# EAGLE schematic Inverter_v1p1 (EAGLE 9.6.2)
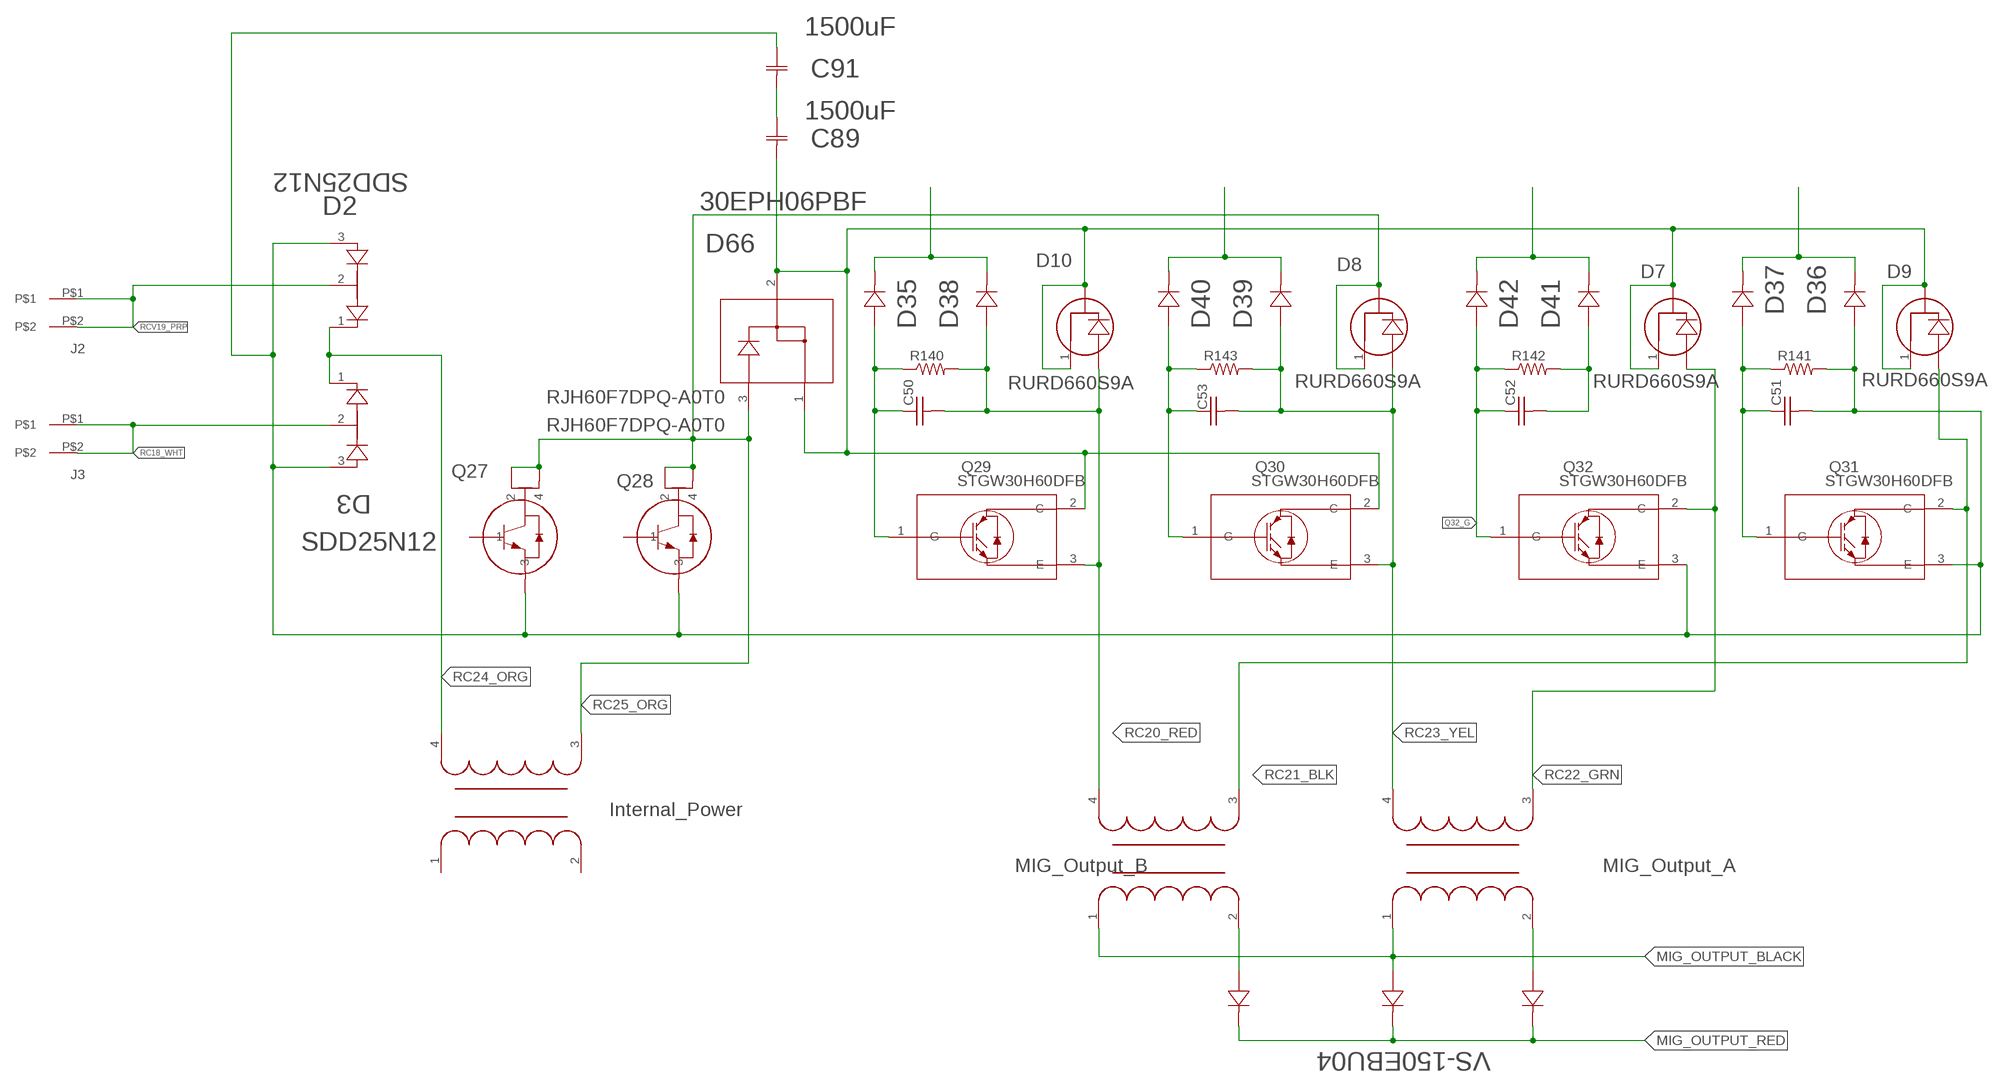
[diagram p0: schematic, sheet 1]

## Parts
C50  C_0805  [0805]
C51  C_0805  [0805]
C52  C_0805  [0805]
C53  C_0805  [0805]
C89  1500uF  C_1500UF  [CAP_SLP152M250H9P3_CND]
C91  1500uF  C_1500UF  [CAP_SLP152M250H9P3_CND]
D2  SDD25N12  [TO-247AD]
D3  SDD25N12  [TO-247AD]
D7  RURD660S9A  [TO-252]
D8  RURD660S9A  [TO-252]
D9  RURD660S9A  [TO-252]
D10  RURD660S9A  [TO-252]
D35  SMAZ18-13-FSMA_DIO-M  [SMA_DIO-M]
D36  SMAZ18-13-FSMA_DIO-M  [SMA_DIO-M]
D37  SMAZ18-13-FSMA_DIO-M  [SMA_DIO-M]
D38  ZJF_638  SMAZ18-13-FSMA_DIO-M  [SMA_DIO-M]
D39  SMAZ18-13-FSMA_DIO-M  [SMA_DIO-M]
D40  SMAZ18-13-FSMA_DIO-M  [SMA_DIO-M]
D41  SMAZ18-13-FSMA_DIO-M  [SMA_DIO-M]
D42  SMAZ18-13-FSMA_DIO-M  [SMA_DIO-M]
D66  30EPH06PBF  [TO-247AC_MOD_VIS]
J2  2-pos  3.81MM_1_X_2_RT_ANGLE_PLUG_HEADER  [2_3.81MM_PITCH]
J3  2-pos  3.81MM_1_X_2_RT_ANGLE_PLUG_HEADER  [2_3.81MM_PITCH]
Q27  RJH60F7DPQ-A0T0  [TO-247A_REN]
Q28  RJH60F7DPQ-A0T0  [TO-247A_REN]
Q29  STGW30H60DFB  [TO-247_STM]
Q30  STGW30H60DFB  [TO-247_STM]
Q31  STGW30H60DFB  [TO-247_STM]
Q32  STGW30H60DFB  [TO-247_STM]
R140  R_0805  [0805]
R141  R_0805  [0805]
R142  R_0805  [0805]
R143  R_0805  [0805]
U$1  GENERIC_TRANSFORMER  [GENERIC_TRANSFORMER]
U$2  GENERIC_TRANSFORMER  [GENERIC_TRANSFORMER]
U$3  GENERIC_TRANSFORMER  [GENERIC_TRANSFORMER]
U$4  VS-150EBU04  [POWER_TAB]
U$5  VS-150EBU04  [POWER_TAB]
U$6  VS-150EBU04  [POWER_TAB]

## Nets
D66_1: C89.2 D7.1(C1) D7.3(C2) D9.1(C1) D9.3(C2) D10.1(C1) D10.3(C2) D66.1 D66.2 Q29.2(C) Q30.2(C)
MIG_OUTPUT_BLACK: U$1.1 U$2.1 U$5.2
MIG_OUTPUT_RED: U$4.1 U$5.1 U$6.1
N$1: U$1.2 U$4.2
N$2: C50.1 D35.2 Q29.1(G) R140.1
N$3: D39.1 D40.1
N$4: U$2.2 U$6.2
N$5: C89.1 C91.2
N$6: D35.1 D38.1
N$7: C53.1 D40.2 Q30.1(G) R143.1
N$8: C51.1 D37.2 Q31.1(G) R141.1
N$9: C52.2 D41.2 R142.2
N$10: D41.1 D42.1
N$11: C51.2 C91.1 D2.3 D3.3 D36.2 Q27.3 Q28.3 Q31.3(E) Q32.3(E) R141.2
N$12: D36.1 D37.1
Q32_G: C52.1 D42.2 Q32.1(G) R142.1
RC18_WHT: D3.2 J3.P$1 J3.P$2
RC20_RED: C50.2 D10.2(A) D38.2 Q29.3(E) R140.2 U$1.4
RC21_BLK: D9.2(A) Q31.2(C) U$1.3
RC22_GRN: D7.2(A) Q32.2(C) U$2.3
RC23_YEL: C53.2 D8.2(A) D39.2 Q30.3(E) R143.2 U$2.4
RC24_ORG: D2.1 D3.1 U$3.4
RC25_ORG: D8.1(C1) D8.3(C2) D66.3 Q27.2 Q27.4 Q28.2 Q28.4 U$3.3
RCV19_PRP: D2.2 J2.P$1 J2.P$2
Unconnected: Q27.1 Q28.1 U$3.1 U$3.2

## Notes on the sheet
- Internal_Power
- MIG_Output_B | MIG_Output_A

## Library data of the parts
C50-C53 = 3D_MIG_Controller:C_0805
C89 C91 = 3D_MIG_Controller:C_1500UF; BUILT_BY: EMA_Kyle; COPYRIGHT: Copyright (C) 2018 Accelerated Designs. All rights reserved; DATASHEET: https://www.cde.com/resources/catalogs/SLP.pdf; MANUFACTURER_PART_NUMBER: SLP152M250H9P3; SOURCELIBRARY: Add_to_database_2021-04-21; VENDOR: Cornell Dubilier
D2 D3 = 3D_MIG_Controller:SDD25N12
D7-D10 = 3D_MIG_Controller:RURD660S9A
D35-D42 = 3D_MIG_Controller:SMAZ18-13-F; BUILT_BY: EMA_UL_Team; MANUFACTURER_PART_NUMBER: SMAZ18-13-F; SOURCELIBRARY: DiodesInc_2015-05-08; VENDOR: Diodes Inc
D66 = 3D_MIG_Controller:30EPH06PBF; BUILT_BY: EMA_UL_Team; MANUFACTURER_PART_NUMBER: 30EPH06PBF; SOURCELIBRARY: Vishay_2020-02-10; VENDOR: Vishay
J2 J3 = 3D_MIG_Controller:3.81MM_1_X_2_RT_ANGLE_PLUG_HEADER: TERM BLOCK HDR 2POS 90DEG 3.81MM; PARTNO: 691322310002
Q27 Q28 = 3D_MIG_Controller:RJH60F7DPQ-A0T0; BUILT_BY: EMA_UL_Team; MANUFACTURER_PART_NUMBER: RJH60F7DPQ-A0#T0; SOURCELIBRARY: Renesas_2011-03-28_IGBT; VENDOR: Renesas Electronics
Q29-Q32 = 3D_MIG_Controller:STGW30H60DFB; BUILT_BY: EMA_Cory; COPYRIGHT: Copyright (C) 2018 Accelerated Designs. All rights reserved; DATASHEET: https://www.st.com/resource/en/datasheet/stgw30h60dfb.pdf; MANUFACTURER_PART_NUMBER: STGW30H60DFB; SOURCELIBRARY: Update_to_database_2020-11-23; VENDOR: STMicroelectronics
R140-R143 = 3D_MIG_Controller:R_0805
U$1-U$3 = 3D_MIG_Controller:GENERIC_TRANSFORMER
U$4-U$6 = 3D_MIG_Controller:VS-150EBU04